# EAGLE design DraginoGateway (EAGLE 5.11)
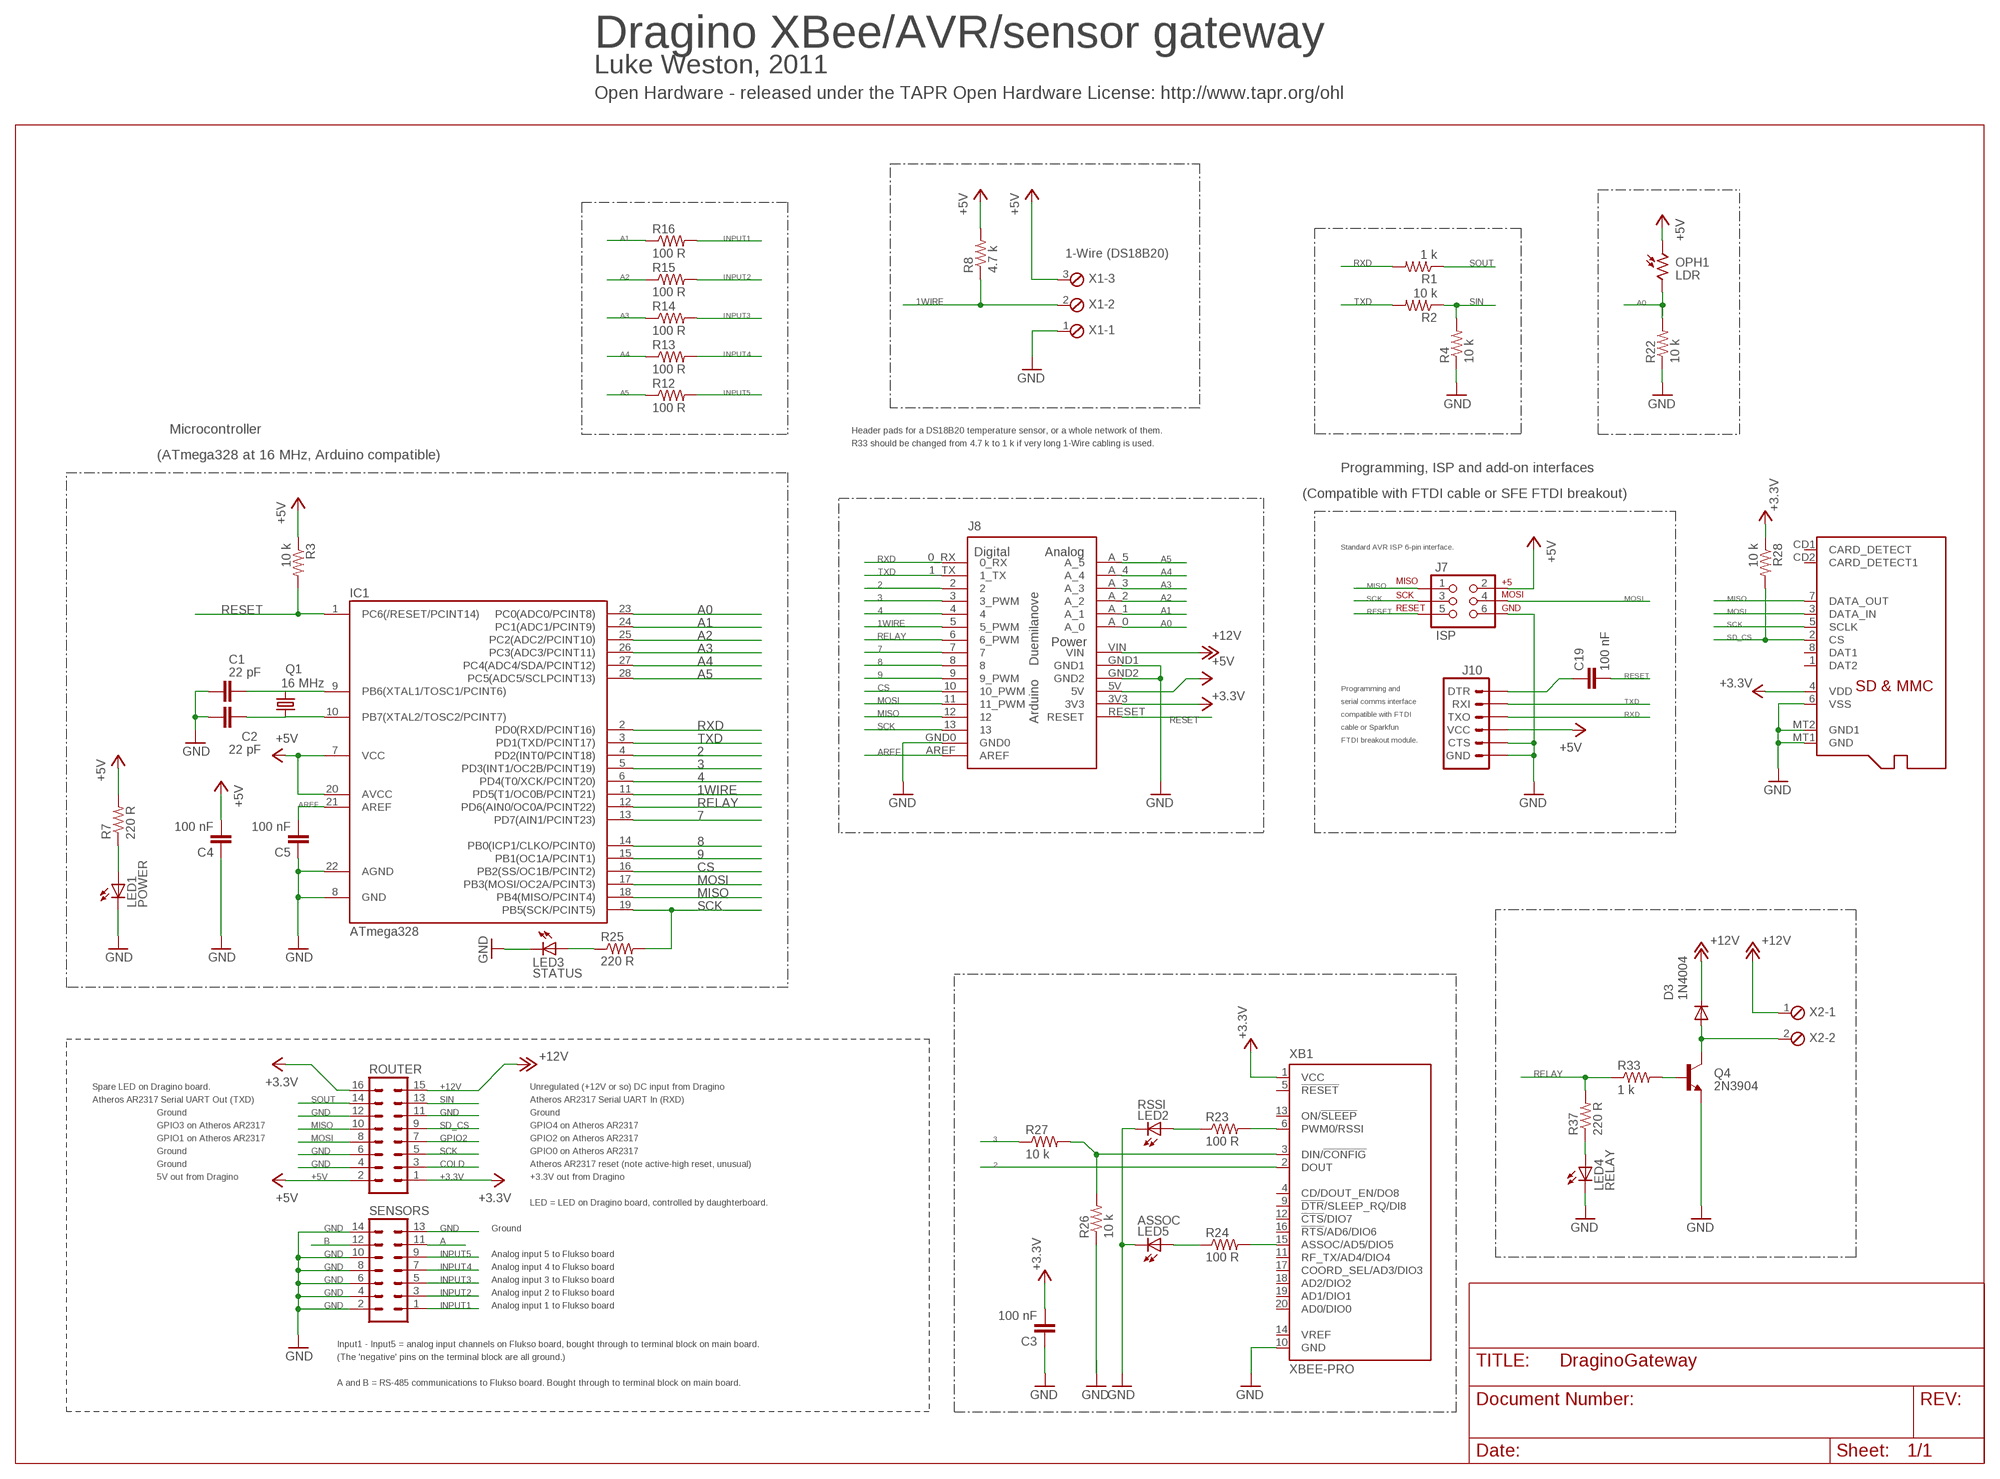
[diagram p0: schematic, sheet 1]

## Parts
C1  22 pF  C-EU025-024X044  [C025-024X044]
C2  22 pF  C-EU025-024X044  [C025-024X044]
C3  100 nF  C-EU050-024X044  [C050-024X044]
C4  100 nF  C-EU050-024X044  [C050-024X044]
C5  100 nF  C-EU050-024X044  [C050-024X044]
C19  100 nF  C-EU050-024X044  [C050-024X044]
D3  1N4004  DIODEPTH  [DIODE-1N4001]
IC1  ATmega328  MEGA48/88/168-PU  [DIL28-3]
J7  ISP  AVR_SPI_PRG_6NS  [2X3-NS]
J8  ARDUINO-USBNO-OUTLINE-NO-TEXT-OCTAGONAL  [NO-OUTLINE-OCTAGONAL-NOTEXT]
J10  Comms  ARDUINO_SERIAL_PROGRAMLONGPADS  [1X06_LONGPADS]
LED1  POWER  LED3MM  [LED3MM]
LED2  RSSI  LED3MM  [LED3MM]
LED3  STATUS  LED3MM  [LED3MM]
LED4  RELAY  LED3MM  [LED3MM]
LED5  ASSOC  LED3MM  [LED3MM]
OPH1  LDR  VT90N1  [VT900]
Q1  16 MHz  CRYSTALHC49US  [HC49US]
Q4  2N3904  TRANSISTOR_NPNTO92  [TO-92]
R1  1 k  R-US_0207/10  [0207/10]
R2  10 k  R-US_0207/10  [0207/10]
R3  10 k  R-US_0207/10  [0207/10]
R4  10 k  R-US_0207/10  [0207/10]
R7  220 R  R-US_0207/10  [0207/10]
R8  4.7 k  R-US_0207/10  [0207/10]
R12  100 R  R-US_0207/10  [0207/10]
R13  100 R  R-US_0207/10  [0207/10]
R14  100 R  R-US_0207/10  [0207/10]
R15  100 R  R-US_0207/10  [0207/10]
R16  100 R  R-US_0207/10  [0207/10]
R22  10 k  R-US_0207/10  [0207/10]
R23  100 R  R-US_0207/10  [0207/10]
R24  100 R  R-US_0207/10  [0207/10]
R25  220 R  R-US_0207/10  [0207/10]
R26  10 k  R-US_0207/10  [0207/10]
R27  10 k  R-US_0207/10  [0207/10]
R28  10 k  R-US_0207/10  [0207/10]
R33  1 k  R-US_0207/10  [0207/10]
R37  220 R  R-US_0207/10  [0207/10]
ROUTER  MA08-2  [MA08-2]
SENSORS  MA07-2  [MA07-2]
U$1  MICROSD  [MICROSD]
X1  1-Wire (DS18B20)  MPT3  [3POL254]
X2  MPT2  [2POL254]
XB1  XBEE-PRO  [XBEE-PRO]

## Nets
1WIRE: IC1.11(PD5(T1/OC0B/PCINT21)) J8.5(5_PWM) R8.1 X1.2
2: IC1.4(PD2(INT0/PCINT18)) J8.2 XB1.2(DOUT)
3: IC1.5(PD3(INT1/OC2B/PCINT19)) J8.3(3_PWM) R27.1
4: IC1.6(PD4(T0/XCK/PCINT20)) J8.4
7: IC1.13(PD7(AIN1/PCINT23)) J8.7
8: IC1.14(PB0(ICP1/CLKO/PCINT0)) J8.8
9: IC1.15(PB1(OC1A/PCINT1)) J8.9(9_PWM)
+3.3V: C3.2 J8.3V3 R28.1 ROUTER.1 ROUTER.16 U$1.4(VDD) XB1.1(VCC)
+5V: C4.2 IC1.7(VCC) IC1.20(AVCC) J7.2 J8.5V J10.4(VCC) OPH1.1 R3.1 R7.2 R8.2 ROUTER.2 X1.3
+12V: D3.C J8.VIN ROUTER.15 X2.1
A: SENSORS.11
A0: IC1.23(PC0(ADC0/PCINT8)) J8.A_0 OPH1.2 R22.2
A1: IC1.24(PC1(ADC1/PCINT9)) J8.A_1 R16.1
A2: IC1.25(PC2(ADC2/PCINT10)) J8.A_2 R15.1
A3: IC1.26(PC3(ADC3/PCINT11)) J8.A_3 R14.1
A4: IC1.27(PC4(ADC4/SDA/PCINT12)) J8.A_4 R13.1
A5: IC1.28(PC5(ADC5/SCLPCINT13)) J8.A_5 R12.1
AREF: C5.2 IC1.21(AREF) J8.AREF
B: SENSORS.12
COLD: ROUTER.3
CS: IC1.16(PB2(SS/OC1B/PCINT2)) J8.10(10_PWM)
GND: C1.2 C2.2 C3.1 C4.1 C5.1 IC1.8(GND) IC1.22(AGND) J7.6 J8.GND0 J8.GND1 J8.GND2 J10.5(CTS) J10.6(GND) LED1.K(C) LED2.K(C) LED3.K(C) LED4.K(C) LED5.K(C) Q4.1(E) R4.1 R22.1 R26.1 ROUTER.4 ROUTER.6 ROUTER.11 ROUTER.12 SENSORS.2 SENSORS.4 SENSORS.6 SENSORS.8 SENSORS.10 SENSORS.13 SENSORS.14 U$1.6(VSS) U$1.MT1(GND) U$1.MT2(GND1) X1.1 XB1.10(GND)
GPIO2: ROUTER.7
INPUT1: R16.2 SENSORS.1
INPUT2: R15.2 SENSORS.3
INPUT3: R14.2 SENSORS.5
INPUT4: R13.2 SENSORS.7
INPUT5: R12.2 SENSORS.9
MISO: IC1.18(PB4(MISO/PCINT4)) J7.1 J8.12 ROUTER.10 U$1.7(DATA_OUT)
MOSI: IC1.17(PB3(MOSI/OC2A/PCINT3)) J7.4 J8.11(11_PWM) ROUTER.8 U$1.3(DATA_IN)
N$1: LED2.A R23.1
N$2: LED5.A R24.1
N$11: R26.2 R27.2 XB1.3(DIN/!CONFIG)
N$13: R23.2 XB1.6(PWM0/RSSI)
N$15: R24.2 XB1.15(ASSOC/AD5/DIO5)
N$28: C1.1 IC1.9(PB6(XTAL1/TOSC1/PCINT6)) Q1.2
N$29: C2.1 IC1.10(PB7(XTAL2/TOSC2/PCINT7)) Q1.1
N$30: C19.1 J10.1(DTR)
N$37: LED4.A R37.1
N$38: Q4.2(B) R33.2
N$666: LED3.A R25.1
N$678: LED1.A R7.1
RELAY: IC1.12(PD6(AIN0/OC0A/PCINT22)) J8.6(6_PWM) R33.1 R37.2
RELAY_OUT: D3.A Q4.3(C) X2.2
RESET: C19.2 IC1.1(PC6(/RESET/PCINT14)) J7.5 J8.RESET R3.2
RXD: IC1.2(PD0(RXD/PCINT16)) J8.0_RX J10.3(TXO) R1.2
SCK: IC1.19(PB5(SCK/PCINT5)) J7.3 J8.13 R25.2 ROUTER.5 U$1.5(SCLK)
SD_CS: R28.2 ROUTER.9 U$1.2(CS)
SIN: R2.1 R4.2 ROUTER.13
SOUT: R1.1 ROUTER.14
TXD: IC1.3(PD1(TXD/PCINT17)) J8.1_TX J10.2(RXI) R2.2
Unconnected: U$1.1(DAT2) U$1.8(DAT1) U$1.CD1(CARD_DETECT) U$1.CD2(CARD_DETECT1) XB1.4(CD/DOUT_EN/DO8) XB1.5(!RESET) XB1.9(!DTR!/SLEEP_RQ/DI8) XB1.11(RF_TX/AD4/DIO4) XB1.12(!CTS!/DIO7) XB1.13(ON/!SLEEP) XB1.14(VREF) XB1.16(!RTS!/AD6/DIO6) XB1.17(COORD_SEL/AD3/DIO3) XB1.18(AD2/DIO2) XB1.19(AD1/DIO1) XB1.20(AD0/DIO0)

## Notes on the sheet
- Dragino XBee/AVR/sensor gateway
- Luke Weston, 2011
- Open Hardware - released under the TAPR Open Hardware License: http://www.tapr.org/ohl
- Microcontroller | Header pads for a DS18B20 temperature sensor, or a whole network of them.
- R33 should be changed from 4.7 k to 1 k if very long 1-Wire cabling is used.
- (ATmega328 at 16 MHz, Arduino compatible)
- Programming, ISP and add-on interfaces
- (Compatible with FTDI cable or SFE FTDI breakout)
- Standard AVR ISP 6-pin interface.
- Programming and
- serial comms interface
- compatible with FTDI
- cable or Sparkfun
- FTDI breakout module.
- Spare LED on Dragino board. | Unregulated (+12V or so) DC input from Dragino
- Atheros AR2317 Serial UART Out (TXD) | Atheros AR2317 Serial UART In (RXD)
- Ground | Ground
- GPIO3 on Atheros AR2317 | GPIO4 on Atheros AR2317
- GPIO1 on Atheros AR2317 | GPIO2 on Atheros AR2317
- Ground | GPIO0 on Atheros AR2317
- Ground | Atheros AR2317 reset (note active-high reset, unusual)
- 5V out from Dragino | +3.3V out from Dragino
- LED = LED on Dragino board, controlled by daughterboard.
- Ground
- Analog input 5 to Flukso board
- Analog input 4 to Flukso board
- Analog input 3 to Flukso board
- Analog input 2 to Flukso board
- Analog input 1 to Flukso board
- Input1 - Input5 = analog input channels on Flukso board, bought through to terminal block on main board.
- (The 'negative' pins on the terminal block are all ground.)
- A and B = RS-485 communications to Flukso board. Bought through to terminal block on main board.

## Library data of the parts
C1-C5 C19 = rcl:C-EU: CAPACITOR, European symbol
D3 = SparkFun:DIODE: Diode These are standard reverse protection diodes and small signal diodes. SMA package can handle up to about 1A. SOD-323 can handle about 200mA. What the SOD-323 package when ordering, there are some mfgs out there that are 5-pin packages.
IC1 = avr-5:MEGA48/88/168-PU
J7 = SparkFun:AVR_SPI_PRG_6: AVR ISP 6 Pin This is the reduced ISP connector for AVR programming. Common on Arduino. This footprint will take up less PCB space and can be used with a 10-pin to 6-pin adapter such as SKU: BOB-08508
J8 = Arduino-Various:ARDUINO-USB: The Ardiuno Duemilanove Pinouts layoutet as a Bare Shield. v0.5 Also for Arduino Diecimila. This is designed as a Part and has no Outline in the Dimension Layer. The Outline, when present, is drawed at the tPlace / bPlace Layer. Library by Stephanie Lange, http://www.k-ita.de/~sl/
J10 = SparkFun:ARDUINO_SERIAL_PROGRAM
LED1-LED5 = SparkFun:LED: LEDs Standard schematic elements and footprints for 5mm, 3mm, 1206, and 0603 sized LEDs. 5mm - Spark Fun Electronics SKU : COM-00529 (and others)
OPH1 = photo-elements:VT9: Photoconductive Cell VT900 Series Source: http://optoelectronics.perkinelmer.com/content/Datasheets/DTS_vt900seriesdatasheet.pdf
Q1 = SparkFun:CRYSTAL: Crystals Various standard crystals. Proven footprints. Spark Fun Electronics SKU : COM-00534
Q4 = SparkFun:TRANSISTOR_NPN: Transistor NPN BJT configuration in SOT23 package. MMBT2222 is the common NPN we use. Double check BCE configuration again layout.
R1-R4 R7 R8 R12-R16 R22-R28 R33 R37 = rcl:R-US_: RESISTOR, American symbol
ROUTER = con-lstb:MA08-2: PIN HEADER
SENSORS = con-lstb:MA07-2: PIN HEADER
U$1 = adafruit:MICROSD: Micro-SD / Transflash card holder with SPI pinout For the 3M # 2908-05WB-MG and/or 4UCON #19656 push-push type
X1 = con-phoenix-254:MPT3: PHOENIX CONNECTOR; OC_FARNELL: unknown; OC_NEWARK: unknown
X2 = con-phoenix-254:MPT2: PHOENIX CONNECTOR; OC_FARNELL: unknown; OC_NEWARK: unknown
XB1 = maxstream:XBEE: XBee (TM) /XBee-PRO(TM) OEM RF Modules Source: MaxStream, Inc. xbee_productmanual.pdf; MPN: XBP24-AWI-001; OC_FARNELL: 1337916; OC_NEWARK: 42M2667

## Board
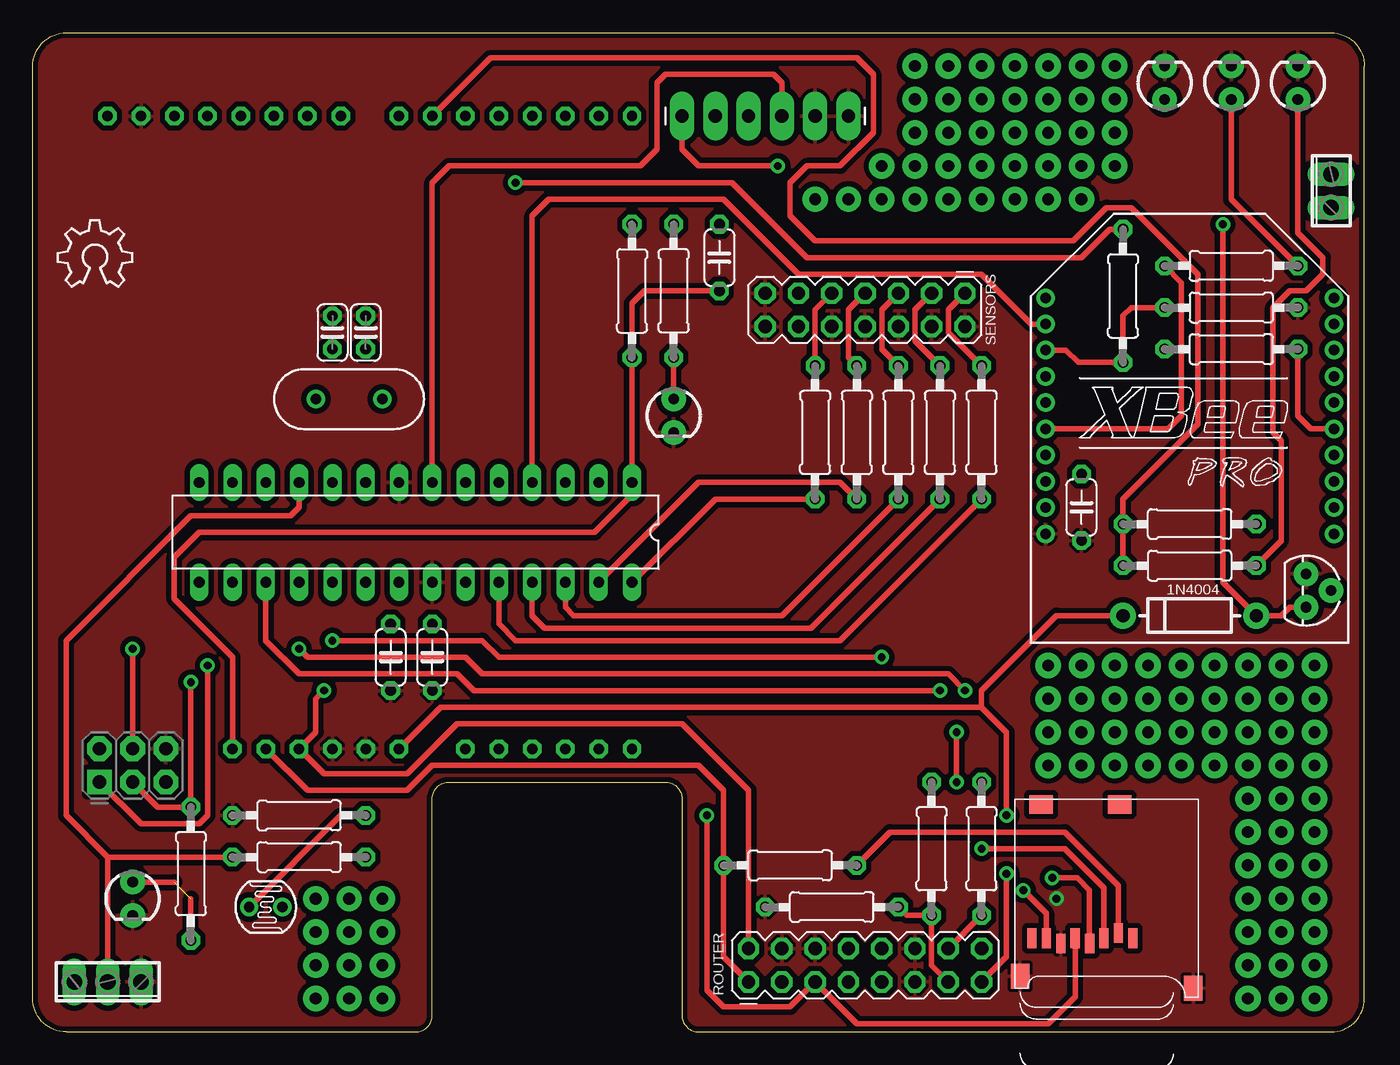
[diagram p1: board, top side]
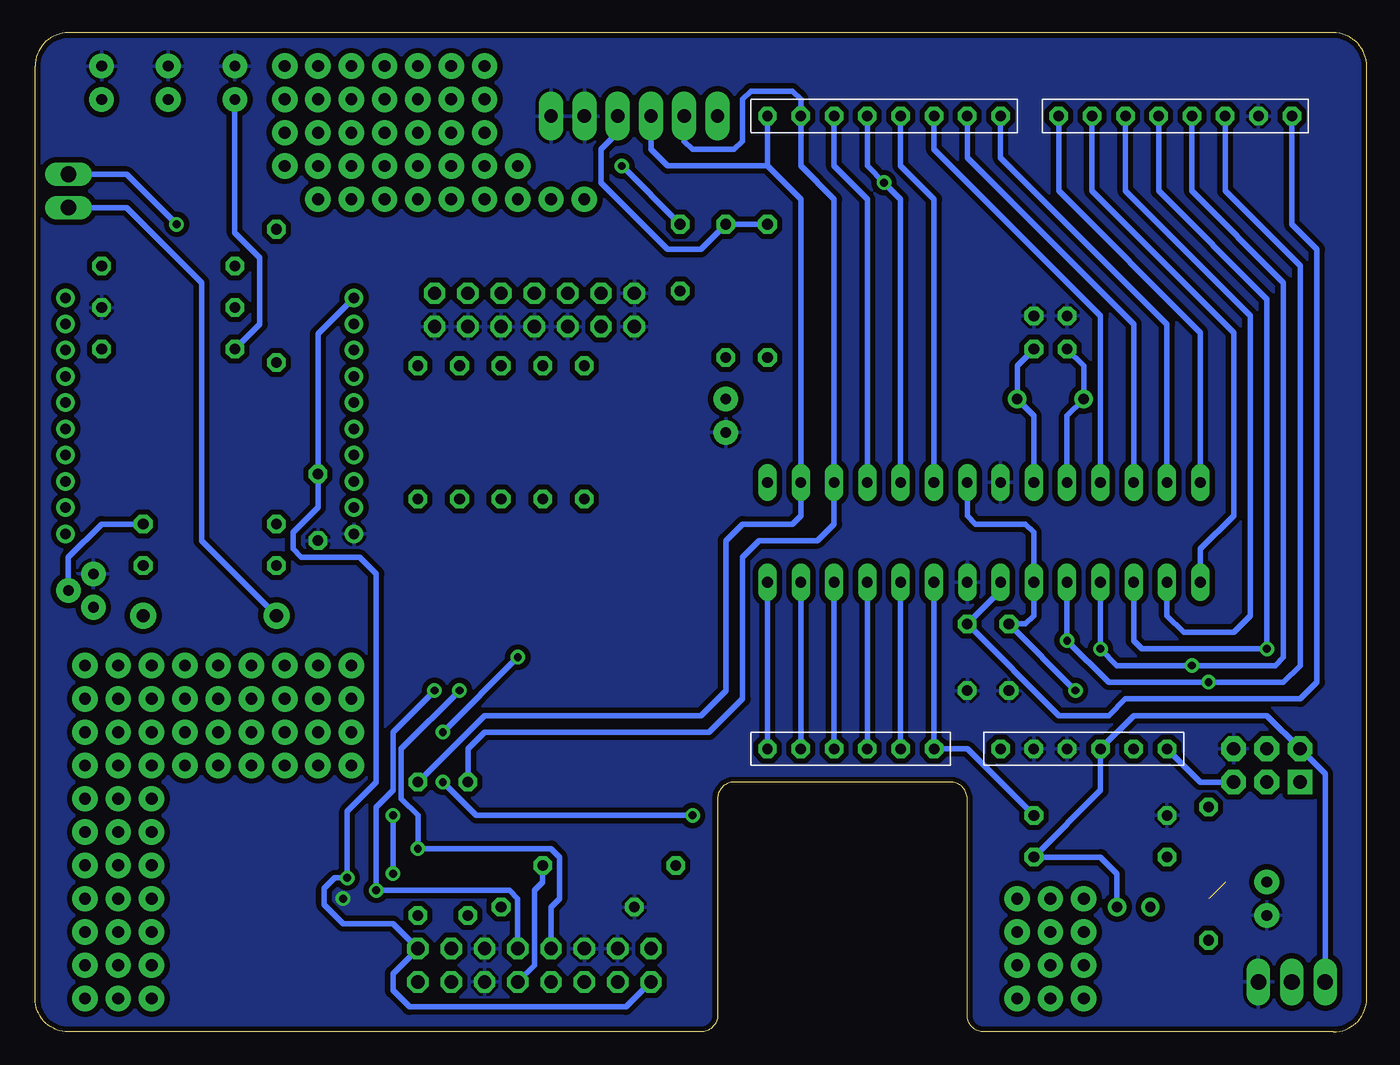
[diagram p2: board, bottom side, seen from below]

Size 101.6 x 76.2 mm. Coordinates in mm from the lower left corner, seen from the top.
Outline: 101.6,2.54 101.6,73.66 arc90 99.06,76.2 2.54,76.2 arc90 0,73.66 0,2.54 arc90 2.54,0 29.21,0 arc90 30.48,1.27 30.48,17.78 arc-90 31.75,19.05 48.26,19.05 arc-90 49.53,17.78 49.53,1.27 arc90 50.8,0 99.06,0 arc90 101.6,2.54
Copper layers (1*16): Top 0.035mm / dielectric 1.5mm / Bottom 0.035mm
Design rules "SparkFun.drc": minimum track width 8mil, minimum drill 20mil, track to track 8mil, track to pad 8mil, pad to pad 8mil, via to via 8mil, smd to smd 8mil, copper to edge 10mil, drill to drill 8mil, minimum pad ring 12mil, minimum via ring 10mil, stop-mask expansion 4mil, vias tented up to drill 25mil, thermal gap 10mil

### Footprints (pad centres in the part's own frame; a part is rotated, then mirrored left to right if it is on the bottom)
C025-024X044 = drill 0.813 octagon: 1 -1.27,0; 2 1.27,0
C050-024X044 = drill 0.813 octagon: 1 -2.54,0; 2 2.54,0
DIODE-1N4001 = drill 1 pad 1.981 round: A -5.08,0; C 5.08,0
DIL28-3 = drill 0.813 long: 1 -16.51,-3.81; 2 -13.97,-3.81; 3 -11.43,-3.81; 4 -8.89,-3.81; 5 -6.35,-3.81; 6 -3.81,-3.81; 7 -1.27,-3.81; 8 1.27,-3.81; 9 3.81,-3.81; 10 6.35,-3.81; 11 8.89,-3.81; 12 11.43,-3.81; 13 13.97,-3.81; 14 16.51,-3.81; 15 16.51,3.81; 16 13.97,3.81; 17 11.43,3.81; 18 8.89,3.81; 19 6.35,3.81; 20 3.81,3.81; 21 1.27,3.81; 22 -1.27,3.81; 23 -3.81,3.81; 24 -6.35,3.81; 25 -8.89,3.81; 26 -11.43,3.81; 27 -13.97,3.81; 28 -16.51,3.81
2X3-NS = drill 1.016 pad 1.88 square: 1 -2.54,-1.27 | drill 1.016 pad 1.88 octagon: 2 -2.54,1.27; 3 0,-1.27; 4 0,1.27; 5 2.54,-1.27; 6 2.54,1.27
NO-OUTLINE-OCTAGONAL-NOTEXT = drill 0.8 pad 1.27 octagon: 0_RX -25.4,27.94; 1_TX -25.4,25.4; 2 -25.4,22.86; 3 -25.4,20.32; 3V3 22.86,0; 4 -25.4,17.78; 5 -25.4,15.24; 5V 22.86,2.54; 6 -25.4,12.7; 7 -25.4,10.16; 8 -25.4,5.715; 9 -25.4,3.175; 10 -25.4,0.635; 11 -25.4,-1.905; 12 -25.4,-4.445; 13 -25.4,-6.985; A_0 22.86,15.24; A_1 22.86,17.78; A_2 22.86,20.32; A_3 22.86,22.86; A_4 22.86,25.4; A_5 22.86,27.94; AREF -25.4,-12.065; GND0 -25.4,-9.525; GND1 22.86,7.62; GND2 22.86,5.08; RESET 22.86,-2.54; VIN 22.86,10.16
1X06_LONGPADS = drill 1.016 pad 1.88 long: 1 0,0; 2 2.54,0; 3 5.08,0; 4 7.62,0; 5 10.16,0; 6 12.7,0
LED3MM = drill 0.813 pad 1.88 round: A -1.27,0; K 1.27,0
VT900 = drill 0.8 pad 1.4 round: 1 -1.27,0; 2 1.27,0
HC49US = drill 0.813 round: 1 -2.54,0; 2 2.54,0
TO-92 = drill 0.813 pad 1.88 round: 1 -1.27,0; 2 0,1.905; 3 1.27,0
0207/10 = drill 0.813 octagon: 1 -5.08,0; 2 5.08,0
MA08-2 = drill 1.016 octagon: 1 -8.89,-1.27; 2 -8.89,1.27; 3 -6.35,-1.27; 4 -6.35,1.27; 5 -3.81,-1.27; 6 -3.81,1.27; 7 -1.27,-1.27; 8 -1.27,1.27; 9 1.27,-1.27; 10 1.27,1.27; 11 3.81,-1.27; 12 3.81,1.27; 13 6.35,-1.27; 14 6.35,1.27; 15 8.89,-1.27; 16 8.89,1.27
MA07-2 = drill 1.016 octagon: 1 -7.62,-1.27; 2 -7.62,1.27; 3 -5.08,-1.27; 4 -5.08,1.27; 5 -2.54,-1.27; 6 -2.54,1.27; 7 0,-1.27; 8 0,1.27; 9 2.54,-1.27; 10 2.54,1.27; 11 5.08,-1.27; 12 5.08,1.27; 13 7.62,-1.27; 14 7.62,1.27
MICROSD = smd 0.7 x 1.5: 1 9,-10.64; 2 7.9,-10.24; 3 6.8,-10.64; 4 5.7,-11.04; 5 4.6,-10.64; 6 3.5,-11.04; 7 2.4,-10.64; 8 1.3,-10.64 | smd 1.8 x 1.4: CD1 2,-0.44; CD2 8,-0.44 | smd 1.4 x 1.9: MT1 0.4,-13.54; MT2 13.6,-14.44
3POL254 = drill 1.2 long: 1 -2.54,0; 2 0,0; 3 2.54,0
2POL254 = drill 1.2 long: 1 -1.27,0; 2 1.27,0
XBEE-PRO = drill 0.8 pad 1.27 round: 1 -11,9; 2 -11,7; 3 -11,5; 4 -11,3; 5 -11,1; 6 -11,-1; 7 -11,-3; 8 -11,-5; 9 -11,-7; 10 -11,-9; 11 11,-9; 12 11,-7; 13 11,-5; 14 11,-3; 15 11,-1; 16 11,1; 17 11,3; 18 11,5; 19 11,7; 20 11,9

### Placement (x,y rotation side)
C1  25.4,53.34 90 top
C2  22.86,53.34 90 top
C3  80.01,40.01 90 top
C4  27.3,28.57 90 top
C5  30.48,28.57 90 top
C19  52.39,59.05 270 top
D3  88.27,31.75 180 top
IC1  29.21,38.1 180 top
J7  7.62,20.32 0 top
J8  17.78,44.45 270 top
J10  49.53,69.85 0 top
LED1  48.89,46.99 270 top
LED2  91.44,72.39 90 top
LED3  7.62,10.16 270 top
LED4  96.52,72.39 90 top
LED5  86.36,72.39 90 top
OPH1  17.78,9.53 180 top
Q1  24.13,48.26 0 top
Q4  97.16,33.66 270 top
R1  72.39,13.97 90 top
R2  68.58,13.97 90 top
R3  45.72,56.52 270 top
R4  60.96,9.53 0 top
R7  48.89,56.52 90 top
R8  20.32,13.34 0 top
R12  59.69,45.72 90 top
R13  62.87,45.72 90 top
R14  66.04,45.72 90 top
R15  69.22,45.72 90 top
R16  72.39,45.72 90 top
R22  20.32,16.51 0 top
R23  91.44,58.42 180 top
R24  91.44,52.07 0 top
R25  12.07,12.06 90 top
R26  91.44,55.24 180 top
R27  83.19,56.13 270 top
R28  57.78,12.7 0 top
R33  88.27,38.73 0 top
R37  88.27,35.56 180 top
ROUTER  63.5,5.08 0 top
SENSORS  63.5,55.07 180 top
U$1  74.93,17.78 0 top
U$2  [OSHW_8X200_NOTEXT]  1.9,56.83 0 top
X1  5.71,3.81 180 top
X2  99.06,64.14 90 top
XB1  88.27,46.99 0 top

### Tracks (layer width: path | path; a pad name or v marks a point on that pad's centre or on a via)
1WIRE
  Top 0.406: X1.2 5.71,13.34 | 5.71,13.34 2.54,16.51 2.54,29.84 12.07,39.37 19.68,39.37 20.32,40.01 IC1.11 | 5.71,13.34 R8.1
  Bottom 0.406: IC1.11 20.32,54.61 33.02,67.31 J8.5
2
  Top 0.406: IC1.4 38.1,62.23 39.37,63.5 52.7,63.5 58.42,57.78 72.39,57.78 76.2,53.98 77.25,53.98 XB1.2
  Bottom 0.406: IC1.4 38.1,63.5 40.64,66.04 J8.2
3  (via drill 0.6)
  Top 0.406: v36.83,64.77 53.34,64.77 59.05,59.05 80.01,59.05 82.17,61.21 R27.1
  Bottom 0.406: IC1.5 35.56,63.5 v36.83,64.77 38.1,66.04 J8.3
4
  Bottom 0.406: IC1.6 33.02,63.5 35.56,66.04 J8.4
7
  Bottom 0.406: IC1.13 15.24,53.98 27.94,66.67 J8.7
8
  Bottom 0.406: IC1.14 12.7,53.34 23.5,64.14 J8.8
9
  Bottom 0.406: J8.9 20.96,64.14 10.16,53.34 10.16,39.37 12.7,36.83 IC1.15
+3.3V  (via drill 0.6)
  Top 0.406: J8.3V3 20.96,18.41 28.57,18.41 30.48,20.32 50.8,20.32 52.7,18.41 R28.1 52.7,5.71 ROUTER.1 | v77.79,11.75 79.69,11.75 80.63,10.81 U$1.4
  Bottom 0.406: XB1.1 80.01,53.24 C3.2 80.01,40.01 81.92,38.1 81.92,36.83 81.28,36.2 76.84,36.2 75.56,34.92 75.56,19.05 77.79,16.83 v77.79,11.75 78.74,11.75 79.53,10.95 79.53,9.68 78.11,8.26 74.3,8.26 ROUTER.16 74.3,4.45 74.3,3.17 73.03,1.91 56.51,1.91 ROUTER.1
+5V  (via drill 0.6)
  Top 0.406: IC1.7 30.48,64.77 31.75,66.04 46.35,66.04 47.62,67.31 47.62,72.39 48.26,73.03 56.51,73.03 57.15,72.39 J10.4 | ROUTER.2 54.61,18.41 49.53,23.5 32.38,23.5 28.57,19.68 22.23,19.68 J8.5V 21.59,22.86 21.59,25.4 v22.23,26.04
  Bottom 0.406: IC1.7 30.48,39.37 29.84,38.73 26.04,38.73 25.4,38.1 IC1.20 25.4,31.75 26.04,31.11 C4.2 v22.23,26.04 | X1.3 3.18,19.68 J7.2 7.62,24.13 17.78,24.13 J8.5V 20.32,18.41 R8.2 20.32,13.34 19.05,12.06 OPH1.1 | R3.1 R7.2 50.8,59.69 53.34,59.69 58.42,64.77 58.42,67.31 57.15,68.58 J10.4
+12V  (via drill 0.6)
  Top 0.406: J8.VIN 31.11,24.77 72.39,24.77 | ROUTER.15 74.3,5.71 v74.3,12.06 | v74.3,16.51 74.3,22.86 72.39,24.77 | D3.C 78.11,31.75 72.39,26.04 72.39,24.77
  Bottom 0.406: v74.3,16.51 v74.3,12.06 | X2.1 94.62,62.87 88.9,57.15 88.9,37.47 D3.C
A0
  Top 0.406: OPH1.2 23.5,16.51 R22.2
  Bottom 0.406: IC1.23 J8.A_0 30.48,21.59 R22.2
A1
  Top 0.406: IC1.24 35.56,31.11 36.83,29.84 61.59,29.84 R16.1
  Bottom 0.406: J8.A_1 IC1.24
A2
  Top 0.406: IC1.25 38.1,31.75 39.05,30.8 59.37,30.8 R15.1
  Bottom 0.406: J8.A_2 IC1.25
A3
  Top 0.406: IC1.26 40.64,32.38 41.27,31.75 57.15,31.75 R14.1
  Bottom 0.406: J8.A_3 IC1.26
A4
  Top 0.406: R13.1 61.59,41.91 50.8,41.91 IC1.27
  Bottom 0.406: J8.A_4 IC1.27
A5
  Top 0.406: R12.1 52.07,40.64 IC1.28
  Bottom 0.406: J8.A_5 IC1.28
AREF
  Bottom 0.406: J8.AREF 5.71,61.59 3.81,59.69 3.81,26.67 5.08,25.4 18.41,25.4 19.68,24.13 23.5,24.13 C5.2 27.94,33.66 IC1.21
CS
  Bottom 0.406: J8.10 18.41,64.14 8.89,54.61 8.89,31.75 10.16,30.48 13.97,30.48 15.24,31.75 IC1.16
GND  (via drill 0.6)
  other vias: 78.11,10.16
  pour Bottom (isolate 0.406): -1.27,77.47 102.87,77.47 102.87,-1.27 -1.27,-1.27
  pour Top (isolate 0.406): -2.54,78.74 104.14,78.74 104.14,-2.54 -2.54,-2.54
INPUT1
  Top 0.406: R16.2 69.85,53.34 69.85,55.07 SENSORS.1
INPUT2
  Top 0.406: R15.2 67.31,52.7 67.31,55.07 SENSORS.3
INPUT3
  Top 0.406: R14.2 64.77,52.07 64.77,55.07 SENSORS.5
INPUT4
  Top 0.406: R13.2 62.23,51.44 62.23,55.07 SENSORS.7
INPUT5
  Top 0.406: R12.2 59.69,55.07 SENSORS.9
MISO  (via drill 0.6)
  Top 0.406: J7.1 8.26,15.88 12.7,15.88 13.34,16.51 v13.34,27.94 | U$1.7 77.33,9.03 v75.56,10.79 | v20.32,29.21 20.96,28.57 33.02,28.57 34.29,27.3 69.85,27.3 v71.12,26.04
  Bottom 0.406: J8.12 13.34,64.14 6.35,57.15 6.35,28.57 6.99,27.94 v13.34,27.94 19.05,27.94 v20.32,29.21 IC1.18 | ROUTER.10 64.77,10.16 65.41,10.79 v75.56,10.79 75.56,17.14 74.3,18.41 74.3,22.86 v71.12,26.04
MOSI  (via drill 0.6)
  Top 0.406: IC1.17 17.78,29.84 20.32,27.3 32.38,27.3 33.65,26.04 v69.22,26.04 | U$1.3 81.73,10.98 78.74,13.97 v72.39,13.97 | J7.4 v7.62,29.21
  Bottom 0.406: J8.11 15.88,64.14 7.62,55.88 v7.62,29.21 17.14,29.21 17.78,29.84 IC1.17 | v69.22,26.04 73.66,21.59 73.66,17.78 72.39,16.51 v72.39,13.97 62.23,13.97 61.59,13.34 61.59,10.16 62.23,9.53 ROUTER.8
N$1
  Top 0.406: LED2.A 91.44,63.5 R23.1
N$2
  Bottom 0.406: LED5.A 86.36,60.96 84.45,59.05 84.45,53.98 R24.1
N$3  (via drill 0.9 pad 1.93)
  other vias: 21.59,2.54
N$4  (via drill 0.9 pad 1.93)
  other vias: 21.59,5.08
N$5  (via drill 0.9 pad 1.93)
  other vias: 21.59,7.62
N$6  (via drill 0.9 pad 1.93)
  other vias: 97.79,2.54
N$7  (via drill 0.9 pad 1.93)
  other vias: 97.79,5.08
N$8  (via drill 0.9 pad 1.93)
  other vias: 95.25,2.54
N$9  (via drill 0.9 pad 1.93)
  other vias: 97.79,7.62
N$10  (via drill 0.9 pad 1.93)
  other vias: 97.79,10.16
N$11
  Top 0.406: XB1.3 78.82,51.99 79.76,51.05 R27.2 83.19,54.61 83.82,55.24 R26.2
N$12  (via drill 0.9 pad 1.93)
  other vias: 97.79,27.94
N$13
  Top 0.406: XB1.6 86.63,45.99 87.63,46.99 87.63,57.15 R23.2
N$14  (via drill 0.9 pad 1.93)
  other vias: 95.25,27.94
N$15
  Top 0.406: XB1.15 97.52,45.99 96.52,46.99 R24.2
N$16  (via drill 0.9 pad 1.93)
  other vias: 77.47,27.94
N$17  (via drill 0.9 pad 1.93)
  other vias: 80.01,27.94
N$18  (via drill 0.9 pad 1.93)
  other vias: 77.47,25.4
N$19  (via drill 0.9 pad 1.93)
  other vias: 24.13,7.62
N$20  (via drill 0.9 pad 1.93)
  other vias: 26.67,7.62
N$21  (via drill 0.9 pad 1.93)
  other vias: 92.71,2.54
N$22  (via drill 0.9 pad 1.93)
  other vias: 26.67,5.08
N$23  (via drill 0.9 pad 1.93)
  other vias: 92.71,27.94
N$24  (via drill 0.9 pad 1.93)
  other vias: 97.79,25.4
N$25  (via drill 0.9 pad 1.93)
  other vias: 97.79,22.86
N$26  (via drill 0.9 pad 1.93)
  other vias: 77.47,22.86
N$27  (via drill 0.9 pad 1.93)
  other vias: 82.55,27.94
N$28
  Bottom 0.406: C1.1 26.67,50.8 Q1.2 25.4,46.99 IC1.9
N$29
  Bottom 0.406: C2.1 21.59,50.8 Q1.1 22.86,46.99 IC1.10
N$30  (via drill 0.6)
  Top 0.406: J10.1 49.53,67.31 50.8,66.04 v56.83,66.04
  Bottom 0.406: C19.1 v56.83,66.04
N$31  (via drill 0.9 pad 1.93)
  other vias: 77.47,20.32
N$32  (via drill 0.9 pad 1.93)
  other vias: 26.67,2.54
N$33  (via drill 0.9 pad 1.93)
  other vias: 24.13,2.54
N$34  (via drill 0.9 pad 1.93)
  other vias: 24.13,5.08
N$35  (via drill 0.9 pad 1.93)
  other vias: 21.59,10.16
N$36  (via drill 0.9 pad 1.93)
  other vias: 24.13,10.16
N$37
  Top 0.406: LED4.A 96.52,60.96 98.42,59.05 98.42,57.78 97.16,56.52 95.89,56.52 94.62,55.24 94.62,45.72 95.25,45.09 95.25,37.47 R37.1
N$38
  Bottom 0.406: Q4.2 99.06,36.2 96.52,38.73 R33.2
N$39  (via drill 0.9 pad 1.93)
  other vias: 26.67,10.16
N$40  (via drill 0.9 pad 1.93)
  other vias: 67.31,73.66
N$41  (via drill 0.9 pad 1.93)
  other vias: 72.39,66.04
N$42  (via drill 0.9 pad 1.93)
  other vias: 69.85,66.04
N$43  (via drill 0.9 pad 1.93)
  other vias: 67.31,68.58
N$44  (via drill 0.9 pad 1.93)
  other vias: 67.31,71.12
N$45  (via drill 0.9 pad 1.93)
  other vias: 92.71,5.08
N$46  (via drill 0.9 pad 1.93)
  other vias: 95.25,5.08
N$47  (via drill 0.9 pad 1.93)
  other vias: 97.79,12.7
N$48  (via drill 0.9 pad 1.93)
  other vias: 97.79,15.24
N$49  (via drill 0.9 pad 1.93)
  other vias: 97.79,17.78
N$50  (via drill 0.9 pad 1.93)
  other vias: 97.79,20.32
N$51  (via drill 0.9 pad 1.93)
  other vias: 90.17,27.94
N$52  (via drill 0.9 pad 1.93)
  other vias: 87.63,27.94
N$53  (via drill 0.9 pad 1.93)
  other vias: 85.09,27.94
N$54  (via drill 0.9 pad 1.93)
  other vias: 80.01,25.4
N$55  (via drill 0.9 pad 1.93)
  other vias: 82.55,25.4
N$56  (via drill 0.9 pad 1.93)
  other vias: 85.09,25.4
N$57  (via drill 0.9 pad 1.93)
  other vias: 87.63,25.4
N$58  (via drill 0.9 pad 1.93)
  other vias: 90.17,25.4
N$59  (via drill 0.9 pad 1.93)
  other vias: 80.01,20.32
N$60  (via drill 0.9 pad 1.93)
  other vias: 90.17,20.32
N$61  (via drill 0.9 pad 1.93)
  other vias: 92.71,17.78
N$62  (via drill 0.9 pad 1.93)
  other vias: 92.71,15.24
N$63  (via drill 0.9 pad 1.93)
  other vias: 92.71,12.7
N$64  (via drill 0.9 pad 1.93)
  other vias: 92.71,10.16
N$65  (via drill 0.9 pad 1.93)
  other vias: 92.71,7.62
N$66  (via drill 0.9 pad 1.93)
  other vias: 92.71,20.32
N$67  (via drill 0.9 pad 1.93)
  other vias: 85.09,20.32
N$68  (via drill 0.9 pad 1.93)
  other vias: 82.55,20.32
N$69  (via drill 0.9 pad 1.93)
  other vias: 87.63,20.32
N$70  (via drill 0.9 pad 1.93)
  other vias: 80.01,22.86
N$71  (via drill 0.9 pad 1.93)
  other vias: 92.71,25.4
N$72  (via drill 0.9 pad 1.93)
  other vias: 95.25,25.4
N$73  (via drill 0.9 pad 1.93)
  other vias: 95.25,22.86
N$74  (via drill 0.9 pad 1.93)
  other vias: 92.71,22.86
N$75  (via drill 0.9 pad 1.93)
  other vias: 95.25,20.32
N$76  (via drill 0.9 pad 1.93)
  other vias: 95.25,17.78
N$77  (via drill 0.9 pad 1.93)
  other vias: 95.25,15.24
N$78  (via drill 0.9 pad 1.93)
  other vias: 95.25,12.7
N$79  (via drill 0.9 pad 1.93)
  other vias: 95.25,10.16
N$80  (via drill 0.9 pad 1.93)
  other vias: 95.25,7.62
N$81  (via drill 0.9 pad 1.93)
  other vias: 82.55,22.86
N$82  (via drill 0.9 pad 1.93)
  other vias: 85.09,22.86
N$83  (via drill 0.9 pad 1.93)
  other vias: 87.63,22.86
N$84  (via drill 0.9 pad 1.93)
  other vias: 90.17,22.86
N$85  (via drill 0.9 pad 1.93)
  other vias: 82.55,73.66
N$86  (via drill 0.9 pad 1.93)
  other vias: 82.55,66.04
N$87  (via drill 0.9 pad 1.93)
  other vias: 82.55,68.58
N$88  (via drill 0.9 pad 1.93)
  other vias: 80.01,66.04
N$89  (via drill 0.9 pad 1.93)
  other vias: 80.01,73.66
N$90  (via drill 0.9 pad 1.93)
  other vias: 82.55,71.12
N$91  (via drill 0.9 pad 1.93)
  other vias: 77.47,66.04
N$92  (via drill 0.9 pad 1.93)
  other vias: 74.93,66.04
N$93  (via drill 0.9 pad 1.93)
  other vias: 69.85,68.58
N$94  (via drill 0.9 pad 1.93)
  other vias: 69.85,71.12
N$95  (via drill 0.9 pad 1.93)
  other vias: 69.85,73.66
N$96  (via drill 0.9 pad 1.93)
  other vias: 72.39,73.66
N$97  (via drill 0.9 pad 1.93)
  other vias: 72.39,68.58
N$98  (via drill 0.9 pad 1.93)
  other vias: 72.39,71.12
N$99  (via drill 0.9 pad 1.93)
  other vias: 74.93,73.66
N$100  (via drill 0.9 pad 1.93)
  other vias: 77.47,73.66
N$101  (via drill 0.9 pad 1.93)
  other vias: 77.47,71.12
N$102  (via drill 0.9 pad 1.93)
  other vias: 80.01,71.12
N$103  (via drill 0.9 pad 1.93)
  other vias: 80.01,68.58
N$104  (via drill 0.9 pad 1.93)
  other vias: 77.47,68.58
N$105  (via drill 0.9 pad 1.93)
  other vias: 74.93,68.58
N$106  (via drill 0.9 pad 1.93)
  other vias: 74.93,71.12
N$107  (via drill 0.9 pad 1.93)
  other vias: 80.01,63.5
N$108  (via drill 0.9 pad 1.93)
  other vias: 77.47,63.5
N$109  (via drill 0.9 pad 1.93)
  other vias: 64.77,66.04
N$110  (via drill 0.9 pad 1.93)
  other vias: 67.31,66.04
N$111  (via drill 0.9 pad 1.93)
  other vias: 59.69,63.5
N$112  (via drill 0.9 pad 1.93)
  other vias: 62.23,63.5
N$113  (via drill 0.9 pad 1.93)
  other vias: 64.77,63.5
N$114  (via drill 0.9 pad 1.93)
  other vias: 67.31,63.5
N$115  (via drill 0.9 pad 1.93)
  other vias: 69.85,63.5
N$116  (via drill 0.9 pad 1.93)
  other vias: 72.39,63.5
N$117  (via drill 0.9 pad 1.93)
  other vias: 74.93,63.5
N$666  (1 unrouted)
  Top 0.406: R25.1 12.07,10.16 | LED3.A 10.79,11.43
N$678
  Top 0.406: LED1.A R7.1
RELAY
  Top 0.406: J8.6 34.92,74.3 62.87,74.3 64.14,73.03 64.14,68.58 61.59,66.04 59.05,66.04 57.78,64.77 57.78,62.23 59.69,60.33 79.38,60.33 81.92,62.87 83.82,62.87 88.9,57.78 88.9,46.35 83.19,40.64 R33.1 R37.2
  Bottom 0.406: IC1.12 17.78,53.98 30.48,66.67 J8.6
RELAY_OUT  (via drill 0.6)
  Top 0.406: Q4.3 95.89,32.38 95.25,31.75 D3.A 90.81,34.29 v90.81,61.59
  Bottom 0.406: X2.2 94.62,65.41 v90.81,61.59
RESET
  Top 0.406: C19.2 46.67,56.52 45.72,55.56 R3.2 IC1.1 45.72,40.96 42.86,38.1 12.7,38.1 10.79,36.2 10.79,33.02 15.24,28.57 J8.RESET
  Bottom 0.406: J7.5 12.7,19.05 J8.RESET
RXD
  Bottom 0.406: 45.72,66.04 J8.0_RX | 45.72,66.04 43.18,63.5 IC1.2 43.18,39.37 43.81,38.73 47.62,38.73 48.89,37.47 48.89,26.04 50.8,24.13 67.31,24.13 R1.2 | 45.72,66.04 53.34,66.04 54.61,67.31 J10.3
SCK  (via drill 0.6)
  Top 0.406: J7.3 9.53,17.14 R25.2 v12.07,26.67 | U$1.5 79.53,2.69 77.47,0.64 62.87,0.64 ROUTER.5 57.78,1.91 52.7,1.91 51.43,3.17 v51.43,16.51 | v22.86,29.84 34.29,29.84 35.56,28.57 v64.77,28.57 | v70.48,22.86 v70.48,19.05
  Bottom 0.406: J8.13 10.79,64.14 5.08,58.42 5.08,27.94 6.35,26.67 v12.07,26.67 19.68,26.67 v22.86,29.84 IC1.19 | v64.77,28.57 v70.48,22.86 | v70.48,19.05 67.95,16.51 v51.43,16.51
SD_CS
  Top 0.406: U$1.2 82.83,11.15 78.74,15.24 65.41,15.24 R28.2
  Bottom 0.406: ROUTER.9 63.5,5.08 63.5,10.79 62.87,11.43 R28.2
SIN
  Top 0.406: ROUTER.13 68.58,5.08 R2.1 66.67,8.89 R4.2
SOUT
  Top 0.406: ROUTER.14 R1.1
TXD
  Bottom 0.406: J10.2 52.07,67.94 51.43,67.31 48.26,67.31 47.62,67.94 47.62,71.12 46.99,71.75 43.81,71.75 43.18,71.12 J8.1_TX 43.18,66.04 40.64,63.5 IC1.3 40.64,38.73 41.91,37.47 46.35,37.47 47.62,36.2 47.62,25.4 50.16,22.86 67.31,22.86 68.58,21.59 R2.2

### Text on the board
Document: DTR | TXD | RXD | +5V | GND | GND | ARF | GND | 13 | 12 | 11 | 10 | 9 | 8 | 7 | 6 | 5 | 4 | 3 | 2 | 1 | 0 | Dragino AVR/Sensor/XBee Node | Luke Weston, 2011 | luke@lunarnumbat.org | 12V Relay | Open Hardware | Released under the TAPR Open Hardware License | http://www.tapr.org/OHL | RESET | +3.3V | +5V | GND | GND | +12V | A0 | A1 | A2 | A3 | A4 | A5 | 1 | +5V | Data | Gnd | MICRO-SD CARD